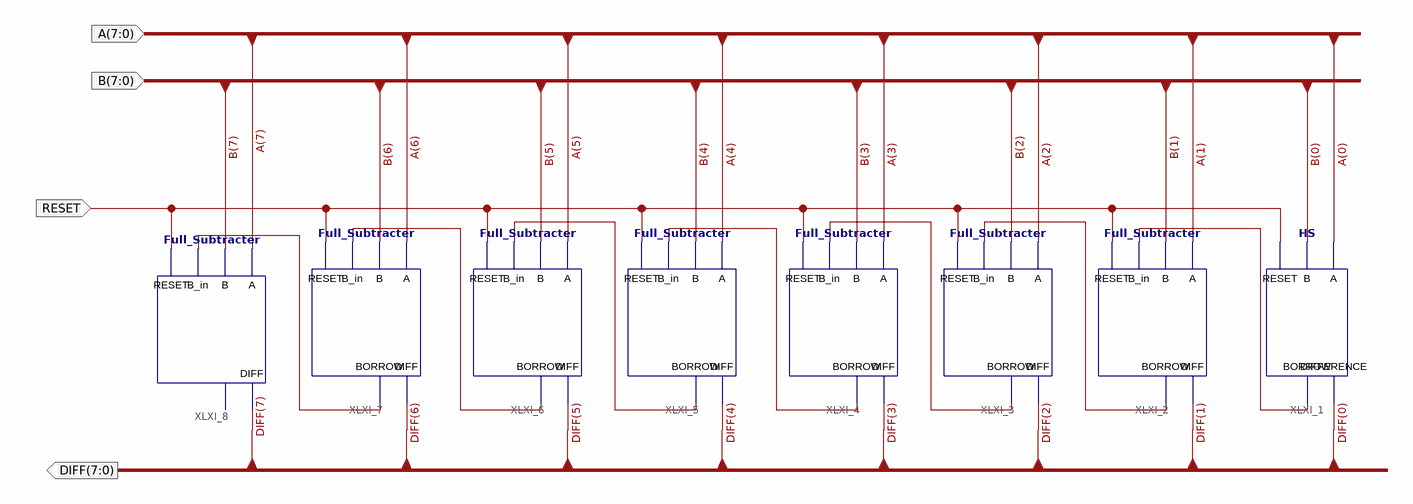
[diagram p0: schematic sheet 1]
// Xilinx ISE schematic Eight_Bit_Subtractor.sch (spartan6) as structural Verilog: 8 symbols, 4 ports
module Eight_Bit_Subtractor (
  input  RESET,
  input  [7:0] A,
  input  [7:0] B,
  output [7:0] DIFF
);

  wire XLXN_2, XLXN_4, XLXN_6, XLXN_8, XLXN_10, XLXN_12, XLXN_14;

  HS XLXI_1 (.A(A[0]), .B(B[0]), .BORROW(XLXN_2), .DIFFERENCE(DIFF[0]), .RESET(RESET));
  Full_Subtracter XLXI_2 (.A(A[1]), .B(B[1]), .BORROW(XLXN_4), .B_in(XLXN_2), .DIFF(DIFF[1]), .RESET(RESET));
  Full_Subtracter XLXI_3 (.A(A[2]), .B(B[2]), .BORROW(XLXN_6), .B_in(XLXN_4), .DIFF(DIFF[2]), .RESET(RESET));
  Full_Subtracter XLXI_4 (.A(A[3]), .B(B[3]), .BORROW(XLXN_8), .B_in(XLXN_6), .DIFF(DIFF[3]), .RESET(RESET));
  Full_Subtracter XLXI_5 (.A(A[4]), .B(B[4]), .BORROW(XLXN_10), .B_in(XLXN_8), .DIFF(DIFF[4]), .RESET(RESET));
  Full_Subtracter XLXI_6 (.A(A[5]), .B(B[5]), .BORROW(XLXN_12), .B_in(XLXN_10), .DIFF(DIFF[5]), .RESET(RESET));
  Full_Subtracter XLXI_7 (.A(A[6]), .B(B[6]), .BORROW(XLXN_14), .B_in(XLXN_12), .DIFF(DIFF[6]), .RESET(RESET));
  Full_Subtracter XLXI_8 (.A(A[7]), .B(B[7]), .B_in(XLXN_14), .DIFF(DIFF[7]), .RESET(RESET));  // open: BORROW
endmodule
